# Altium schematic sheet user_input.SchDoc: SoPC Oscilloscope - User Interface
size A; DrawnBy: Santiago Navonne; Revision: 1.1; SheetNumber: 5; SheetTotal: 5
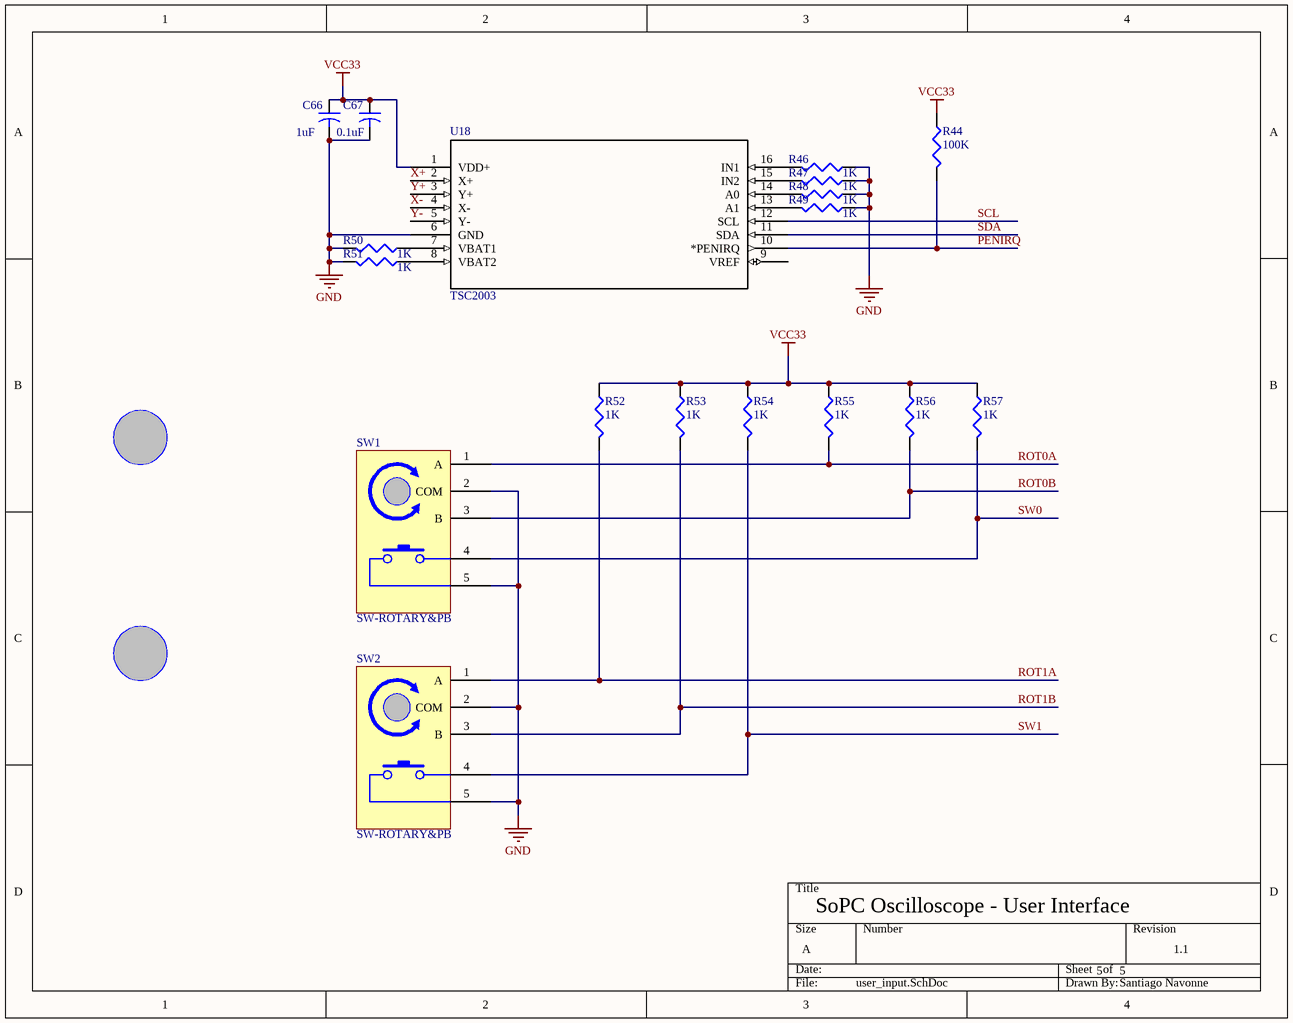
[diagram p0: user_input.SchDoc]

## Parts
C66  value 1uF  [CAPC1608L]  (hidden comment: Cap2)
C67  value 0.1uF  [CAPC1608L]  (hidden comment: Cap2)
R44  value 100K  [RESC1608N]  (hidden comment: Res3)
R46  value 1K  [RESC1608N]  (hidden comment: Res3)
R47  value 1K  [RESC1608N]  (hidden comment: Res3)
R48  value 1K  [RESC1608N]  (hidden comment: Res3)
R49  value 1K  [RESC1608N]  (hidden comment: Res3)
R50  value 1K  [RESC1608N]  (hidden comment: Res3)
R51  value 1K  [RESC1608N]  (hidden comment: Res3)
R52  value 1K  [RESC1608N]  (hidden comment: Res3)
R53  value 1K  [RESC1608N]  (hidden comment: Res3)
R54  value 1K  [RESC1608N]  (hidden comment: Res3)
R55  value 1K  [RESC1608N]  (hidden comment: Res3)
R56  value 1K  [RESC1608N]  (hidden comment: Res3)
R57  value 1K  [RESC1608N]  (hidden comment: Res3)
SW1  SW-ROTARY&PB  [PEC16-4xxxF-Sxxxx]
SW2  SW-ROTARY&PB  [PEC16-4xxxF-Sxxxx]
U18  TSC2003  [PW16]

## Nets
GND: C66.2 C67.2 R46.1 R47.1 R48.1 R49.1 R50.2 R51.2 SW1.2(COM) SW1.5 SW2.2(COM) SW2.5 U18.6(GND)
VCC33: C66.1 C67.1 R44.1 R52.1 R53.1 R54.1 R55.1 R56.1 R57.1 U18.1(VDD+)
PENIRQ: R44.2 U18.10(*PENIRQ)
ROT0A: R55.2 SW1.1(A)
ROT0B: R56.2 SW1.3(B)
ROT1A: R52.2 SW2.1(A)
ROT1B: R53.2 SW2.3(B)
SCL: U18.12(SCL)
SDA: U18.11(SDA)
SW0: R57.2 SW1.4
SW1: R54.2 SW2.4
X+: U18.2(X+)
X-: U18.4(X-)
Y+: U18.3(Y+)
Y-: U18.5(Y-)
NetR46_2: R46.2 U18.16(IN1)
NetR47_2: R47.2 U18.15(IN2)
NetR48_2: R48.2 U18.14(A0)
NetR49_2: R49.2 U18.13(A1)
NetR50_1: R50.1 U18.7(VBAT1)
NetR51_1: R51.1 U18.8(VBAT2)

Not connected (* = marked no-connect by the designer): U18 9(VREF)

## Library data of the parts
C66 C67 = Cap2: Capacitor; Published: 23-Sep-2002; PackageReference: CAPR5-4X5; Publisher: Altium Limited; PackageDescription: Capacitor; 2 Leads
R44 R46-R57 = Res3: Resistor; Published: 8-Jun-2000; LatestRevisionDate: 29-May-2009; LatestRevisionNote: IPC-7351 Footprint Added.; PackageReference: J1-0603; Publisher: Altium Limited; PackageDescription: Chip Resistor
SW1 SW2 = SW-ROTARY&PB: Rotary Encoder with Built-In Push Button
U18 = TSC2003_PW_16: Imported; Manufacturer: Texas Instruments; INDUSTRY_STD_PKG_TYPE: TSSOP; FAMILY_NAME: TOUCH SCREEN CONTROLLER; PIN_COUNT: 16; PACKAGE_DESIGNATOR: PW; Datasheet URL: http://www.ti.com/lit/gpn/TSC2003; GENERIC_PART_NUMBER: TSC2003; RefDes: RefDes; Type: DEV; Value: Value